# EAGLE design main (EAGLE 5.06)
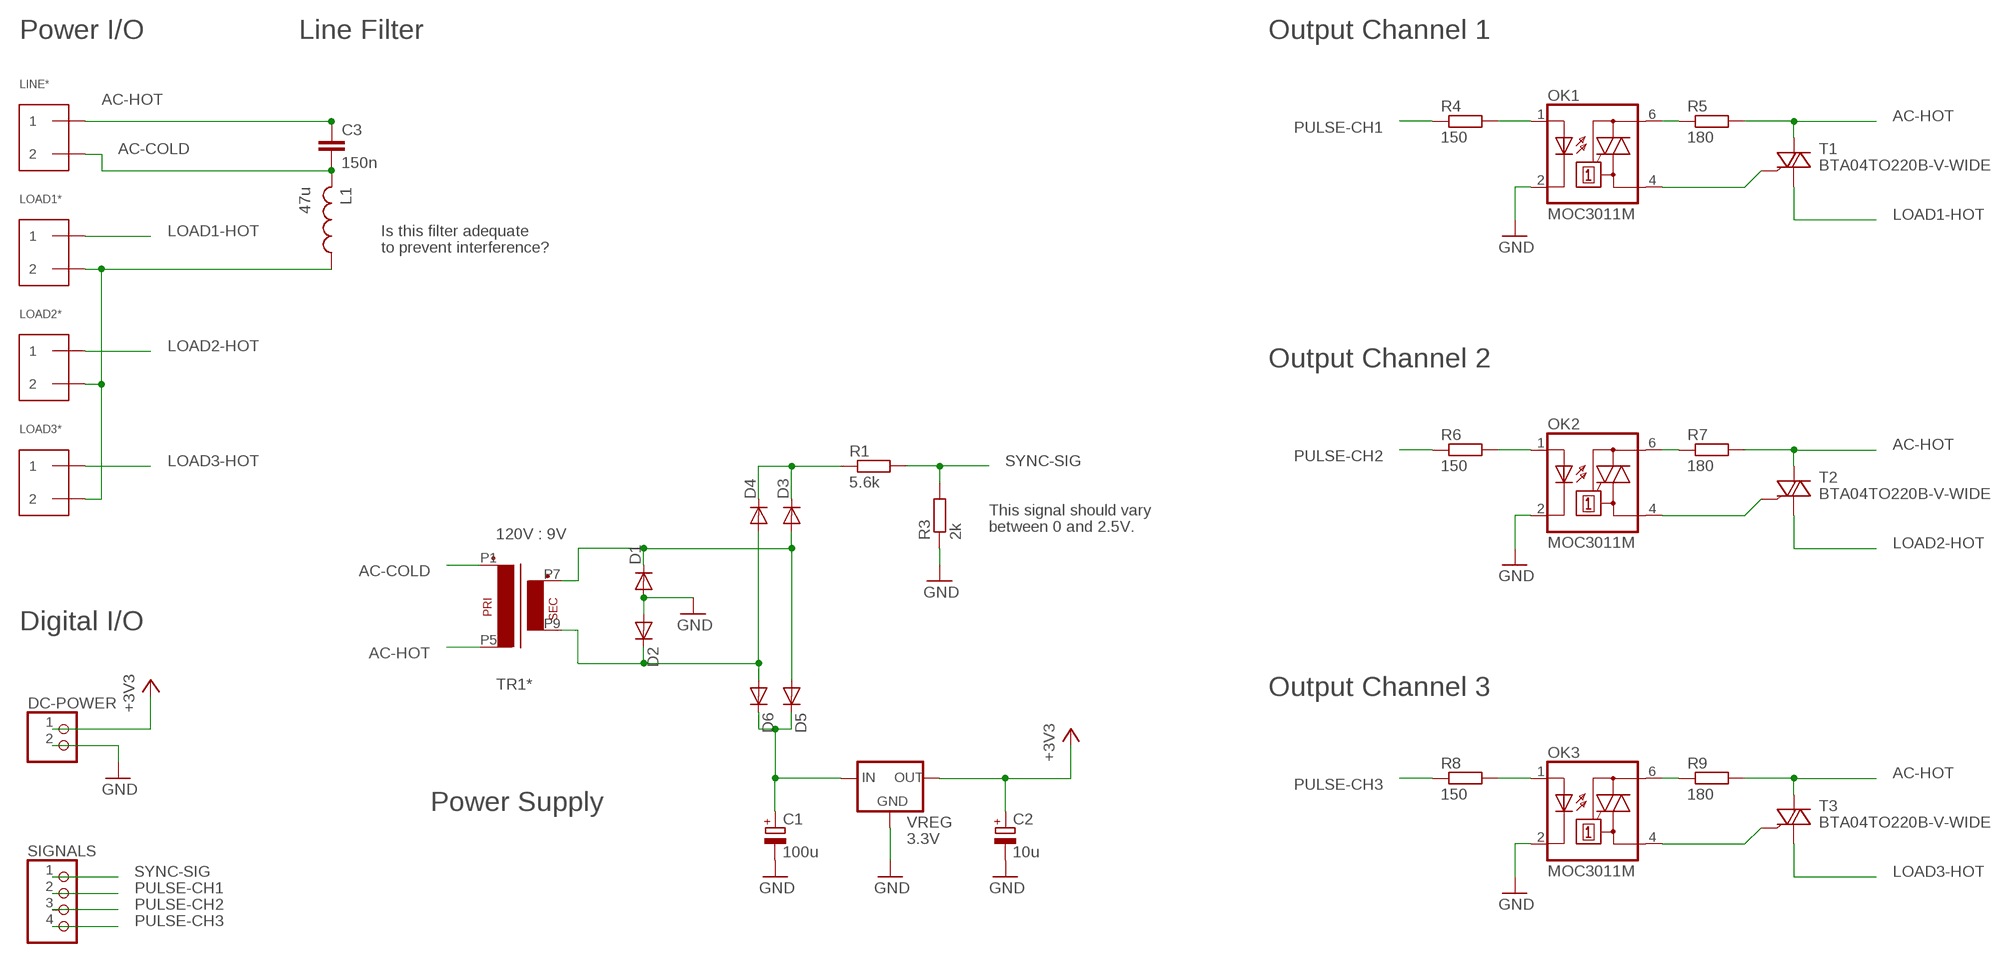
[diagram p0: schematic, sheet 1]

## Parts
C1  100u  CPOL-EUE3.5-8  [E3,5-8]
C2  10u  CPOL-EUE2.5-5  [E2,5-5]
C3  150n  C-EUC1812  [C1812]
D1  1N4148DO35-7  [DO35-7]
D2  1N4148DO35-7  [DO35-7]
D3  1N4148DO35-7  [DO35-7]
D4  1N4148DO35-7  [DO35-7]
D5  1N4148DO35-7  [DO35-7]
D6  1N4148DO35-7  [DO35-7]
DC-POWER  PINHD-1X2STRAIGHT  [1X02]
L1  47u  MURATA-14001447385C  [MURATA-1447385C]
LINE*  TERMINAL-1X2  [TERM-1X2]
LOAD1*  TERMINAL-1X2  [TERM-1X2]
LOAD2*  TERMINAL-1X2  [TERM-1X2]
LOAD3*  TERMINAL-1X2  [TERM-1X2]
OK1  MOC3011M  [DIL06]
OK2  MOC3011M  [DIL06]
OK3  MOC3011M  [DIL06]
R1  5.6k  R-EU_R0805  [R0805]
R3  2k  R-EU_R0805  [R0805]
R4  150  R-EU_R0805  [R0805]
R5  180  R-EU_0207/10  [0207/10]
R6  150  R-EU_R0805  [R0805]
R7  180  R-EU_0207/10  [0207/10]
R8  150  R-EU_R0805  [R0805]
R9  180  R-EU_0207/10  [0207/10]
SIGNALS  PINHD-1X4  [1X04]
T1  BTA04TO220B-V-WIDE  [TO220B-VERT-WIDE]
T2  BTA04TO220B-V-WIDE  [TO220B-VERT-WIDE]
T3  BTA04TO220B-V-WIDE  [TO220B-VERT-WIDE]
TR1*  120V : 9V  TRANFORMER-1P1SPULSE-EL30  [PULSE-TRANSF-EL30]
VREG  3.3V  UA78MXXSOT223  [SOT223]

## Nets
+3V3: C2.+ DC-POWER.1 VREG.3(VOUT)
AC-COLD [AC]: C3.2 L1.P$2 LINE*.2 TR1*.P1(P2)
AC-HOT [AC]: C3.1 LINE*.1 R5.2 R7.2 R9.2 T1.2(A2) T2.2(A2) T3.2(A2) TR1*.P5(P1)
GND: C1.- C2.- D1.A D2.A DC-POWER.2 OK1.2(C) OK2.2(C) OK3.2(C) R3.1 VREG.2(GND)
LOAD1-HOT [AC]: LOAD1*.1 T1.1(A1)
LOAD2-HOT [AC]: LOAD2*.1 T2.1(A1)
LOAD3-HOT [AC]: LOAD3*.1 T3.1(A1)
LOAD-COLD [AC]: L1.P$1 LOAD1*.2 LOAD2*.2 LOAD3*.2
N$1: C1.+ D5.C D6.C VREG.1(VIN)
N$2: D1.C D3.A D5.A TR1*.P7(S3)
N$3: D2.C D4.A D6.A TR1*.P9(S4)
N$4: D3.C D4.C R1.1
N$5: OK1.1(A) R4.2
N$6 [AC]: OK1.4(A1) T1.3(G)
N$7 [AC]: OK1.6(A2) R5.1
N$8: OK2.1(A) R6.2
N$9 [AC]: OK2.4(A1) T2.3(G)
N$10 [AC]: OK2.6(A2) R7.1
N$11: OK3.1(A) R8.2
N$12 [AC]: OK3.4(A1) T3.3(G)
N$13 [AC]: OK3.6(A2) R9.1
PULSE-CH1: R4.1 SIGNALS.2
PULSE-CH2: R6.1 SIGNALS.3
PULSE-CH3: R8.1 SIGNALS.4
SYNC-SIG: R1.2 R3.2 SIGNALS.1

## Notes on the sheet
- Power I/O | Line Filter | Output Channel 1
- Is this filter adequate
- to prevent interference?
- Output Channel 2
- This signal should vary
- between 0 and 2.5V.
- Digital I/O
- Output Channel 3
- Power Supply

## Library data of the parts
C1 C2 = rcl:CPOL-EU: POLARIZED CAPACITOR, European symbol
C3 = rcl:C-EU: CAPACITOR, European symbol
D1-D6 = diode:1N4148: DIODE high speed (Philips)
DC-POWER = pinhead:PINHD-1X2: PIN HEADER
L1 = adam - passive:MURATA-1400: Murata 1400 series inductor
LINE* LOAD1* LOAD2* LOAD3* = adam - mechanical:TERMINAL-1X2
OK1-OK3 = optocoupler:MOC30*M: RANDOM-PHASE OPTOISOLATORS TRIAC DRIVER OUTPUT Source: http://www.fairchildsemi.com MOC3020-M.pdf
R1 R3-R9 = rcl:R-EU_: RESISTOR, European symbol
SIGNALS = pinhead:PINHD-1X4: PIN HEADER
T1-T3 = adam - transistors etc:BTA04: BTA04 TRIAC high gate sensitivity and isolated tab
TR1* = adam - passive:TRANFORMER-1P1S: TRANSFORMER 1 primary winding, 1 secondary winding ERA
VREG = adam - ics:UA78MXX: UA78Mxx voltage regulator available in various fixed voltages

## Net classes
1 AC: width 1.27 mm, clearance 1.194 mm
2 AC fill: clearance 1.778 mm

## Board
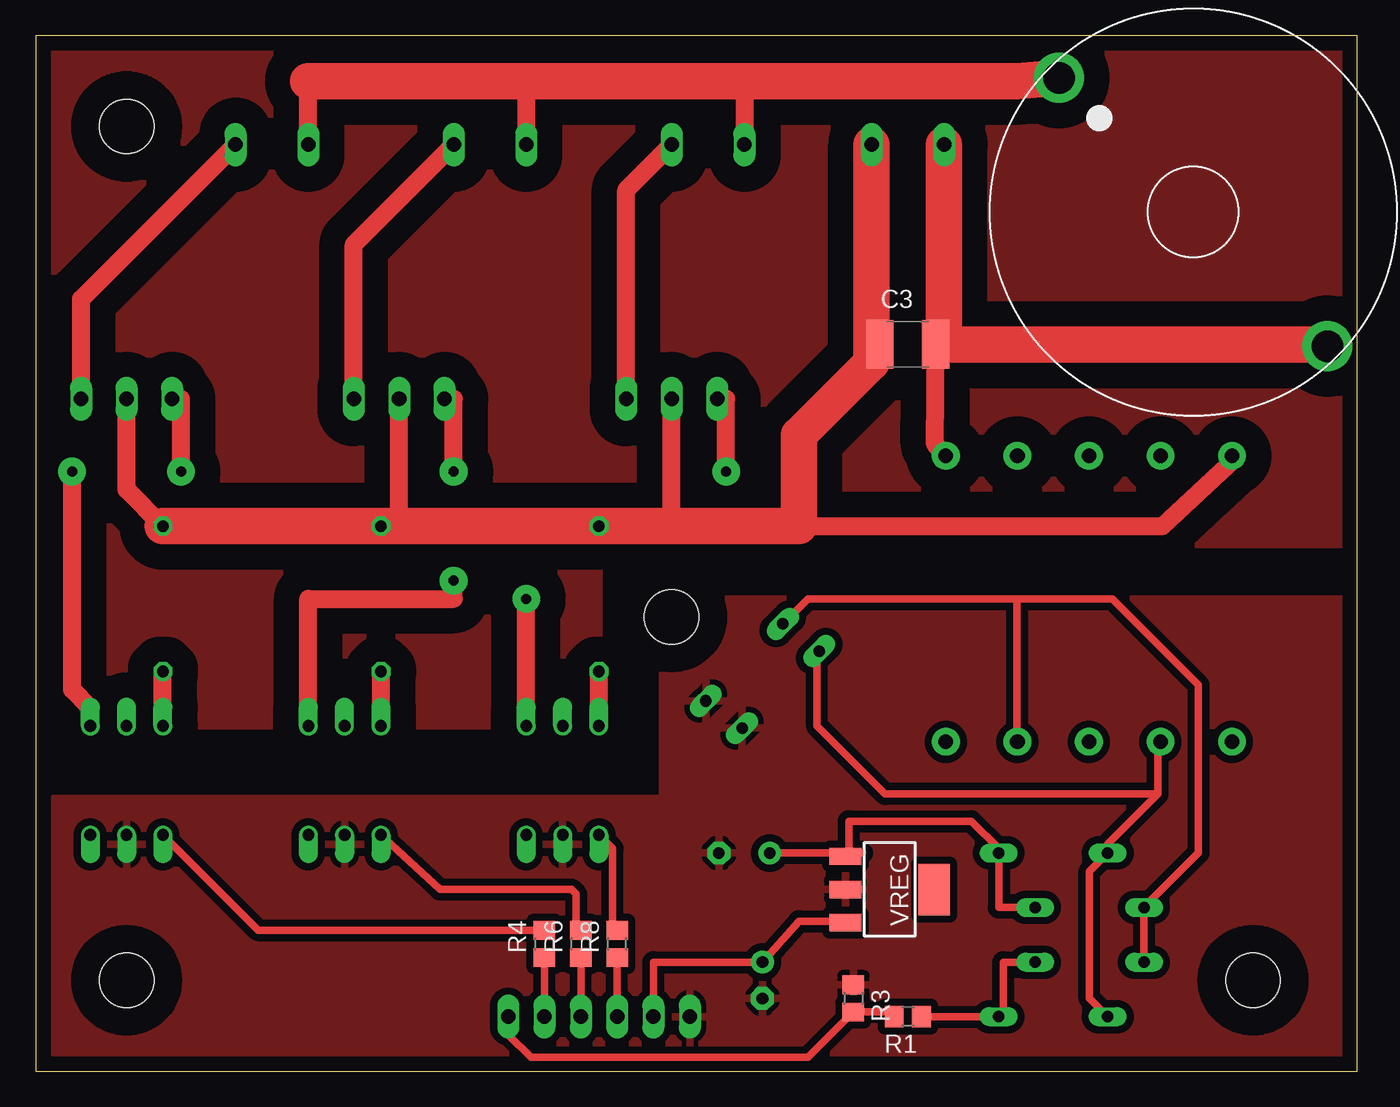
[diagram p1: board, top side]
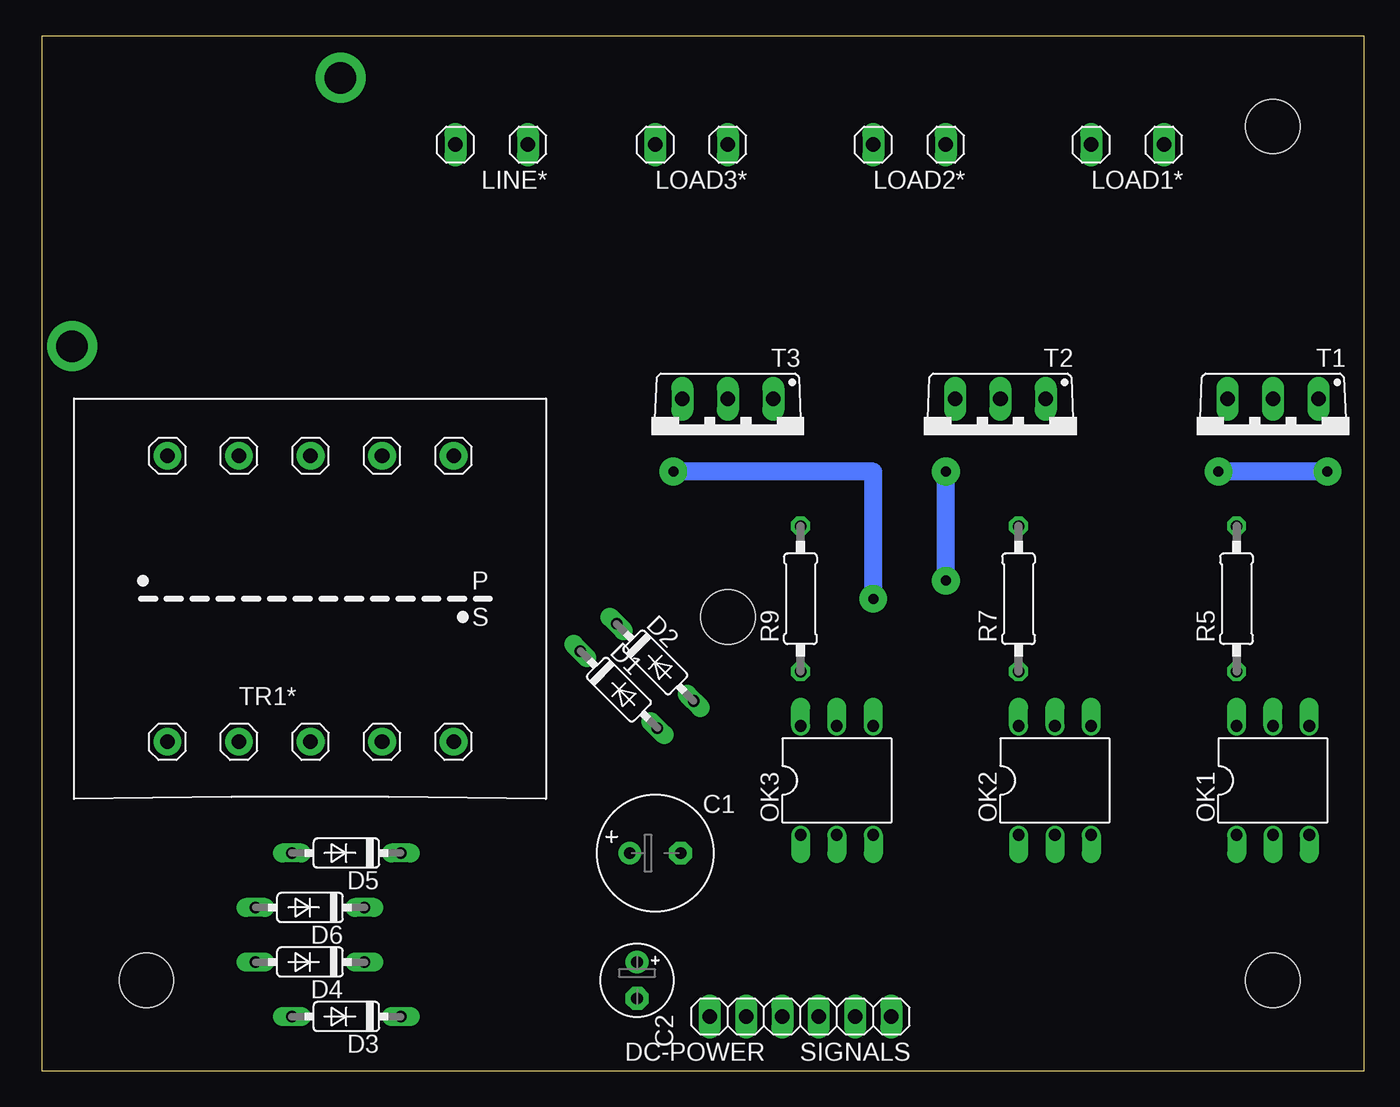
[diagram p2: board, bottom side, seen from below]

Size 92.38 x 72.38 mm. Coordinates in mm from the lower left corner, seen from the top.
Outline: 0,0 92.38,0 92.38,72.38 0,72.38 0,0
Copper layers (1*16): Top 0.035mm / dielectric 1.5mm / Bottom 0.035mm
Design rules "20mil all": minimum track width 20mil, minimum drill 24mil, track to track 20mil, track to pad 20mil, pad to pad 20mil, via to via 20mil, smd to smd 8mil, copper to edge 40mil, drill to drill 8mil, minimum pad ring 10mil, minimum via ring 8mil, stop-mask expansion 4mil, vias tented up to drill 0mil, thermal gap 15mil

### Footprints (pad centres in the part's own frame; a part is rotated, then mirrored left to right if it is on the bottom)
E3,5-8 = drill 0.813 pad 1.6 round: + -1.778,0 | drill 0.813 pad 1.6 octagon: - 1.778,0
E2,5-5 = drill 0.813 pad 1.6 round: + -1.27,0 | drill 0.813 pad 1.6 octagon: - 1.27,0
C1812 = smd 1.9 x 3.4: 1 -1.95,0; 2 1.95,0
DO35-7 = drill 0.813 long: A 3.81,0; C -3.81,0
1X02 = drill 1.016 long: 1 -1.27,0; 2 1.27,0
MURATA-1447385C = drill 2.2 pad 3.5 round: P$1 -12,0; P$2 14.54,0
TERM-1X2 = drill 1.016 long: 1 -2.54,0; 2 2.54,0
DIL06 = drill 0.813 offset: 1 -2.54,-3.81; 2 0,-3.81; 3 2.54,-3.81; 4 2.54,3.81; 5 0,3.81; 6 -2.54,3.81
R0805 = smd 1.3 x 1.5: 1 -0.95,0; 2 0.95,0
0207/10 = drill 0.813 octagon: 1 -5.08,0; 2 5.08,0
1X04 = drill 1.016 long: 1 -3.81,0; 2 -1.27,0; 3 1.27,0; 4 3.81,0
TO220B-VERT-WIDE = drill 1.016 long: 1 -3.175,0; 2 0,0; 3 3.175,0
PULSE-TRANSF-EL30 = drill 1.016 pad 1.93 round: P1 -10.04,-10; P2 -5.04,-10; P3 -0.04,-10; P4 4.96,-10; P5 9.96,-10; P6 9.96,10; P7 4.96,10; P8 -0.04,10; P9 -5.04,10; P10 -10.04,10
PCB-MOUNT = hole 3.797: 0,0
SOT223 = smd 1.219 x 2.235: 1 -2.311,-3.099; 2 0,-3.099; 3 2.311,-3.099 | smd 3.6 x 2.2: 4-TAB 0,3.099

### Placement (x,y rotation side)
C1  49.53,15.24 0 bottom
C2  50.8,6.35 270 bottom
C3  60.96,50.8 0 top
D1  52.07,26.67 315 bottom
D2  49.53,28.58 315 bottom
D3  71.12,3.81 180 bottom
D4  73.66,7.62 180 bottom
D5  71.12,15.24 180 bottom
D6  73.66,11.43 180 bottom
DC-POWER  44.45,3.81 180 bottom
L1  80.01,60.96 315 top
LINE*  60.96,64.77 180 bottom
LOAD1*  16.51,64.77 180 bottom
LOAD2*  31.75,64.77 180 bottom
LOAD3*  46.99,64.77 180 bottom
OK1  6.35,20.32 0 bottom
OK2  21.59,20.32 0 bottom
OK3  36.83,20.32 0 bottom
R1  60.96,3.81 180 top
R3  57.15,5.08 270 top
R4  35.56,8.89 90 top
R5  8.89,33.02 90 bottom
R6  38.1,8.89 90 top
R7  24.13,33.02 90 bottom
R8  40.64,8.89 90 top
R9  39.37,33.02 90 bottom
SIGNALS  36.83,3.81 180 bottom
T1  6.35,46.99 180 bottom
T2  25.4,46.99 180 bottom
T3  44.45,46.99 180 bottom
TR1*  73.66,33.02 180 bottom
U$1  [PCB-MOUNT]  6.35,66.04 0 top
U$2  [PCB-MOUNT]  6.35,6.35 0 top
U$3  [PCB-MOUNT]  85.09,6.35 0 top
U$4  [PCB-MOUNT]  44.45,31.75 0 top
VREG  59.69,12.7 270 top

### Tracks (layer width: path | path; a pad name or v marks a point on that pad's centre or on a via)
+3V3
  Top 0.508: VREG.3 56.52,10.48 53.34,10.48 C2.+ 43.18,7.62 DC-POWER.1
AC-COLD
  Top 1.27: LINE*.2 63.82,58.1 | 63.5,51.44 63.18,51.12 C3.2 62.87,43.81 TR1*.P1
  Top 2.54: LINE*.2 63.5,51.44 64.14,50.8 90.29,50.8 L1.P$2
AC-HOT
  Top 1.27: R5.2 6.35,40.64 T1.2 | 44.45,38.1 T3.2 | 25.4,38.1 T2.2 | 59.05,50.8 C3.1 58.42,50.8 | TR1*.P5 83.82,42.82 78.74,38.1 46.99,38.1
  Top 2.54: LINE*.1 58.42,50.8 58.42,49.53 53.34,44.45 53.34,38.1 46.99,38.1 44.45,38.1 R9.2 25.4,38.1 R7.2 R5.2
GND
  pour Top: 1.27,19.05 43.81,19.05 43.81,33.02 91.44,33.02 91.44,1.27 1.27,1.27
LOAD1-HOT
  Top 1.27: T1.1 3.17,53.98 LOAD1*.1
LOAD2-HOT
  Top 1.27: T2.1 22.23,57.79 LOAD2*.1
LOAD3-HOT
  Top 1.27: T3.1 41.27,61.6 LOAD3*.1
LOAD-COLD
  Top 1.27: LOAD1*.2 19.05,69.22 | 34.29,69.22 LOAD2*.2 | 49.53,69.22 LOAD3*.2
  Top 2.54: 19.05,69.22 34.29,69.22 49.53,69.22 68.58,69.22 L1.P$1
N$1
  Top 0.508: D6.C 67.31,11.43 D5.C 67.31,15.56 65.41,17.46 56.83,17.46 56.83,15.24 | C1.+ 56.83,15.24 | 56.83,15.24 57.78,15.24 56.52,14.92 VREG.1 56.83,15.24
N$2
  Top 0.508: TR1*.P7 78.42,22.86 78.42,19.37 | 78.42,19.37 74.93,15.88 D5.A 73.66,13.97 73.66,5.08 D3.A | D1.C 54.61,29.21 54.61,24.13 59.37,19.37 78.42,19.37
N$3
  Top 0.508: D4.A D6.A 81.28,15.24 81.28,26.99 75.25,33.02 68.58,33.02 | 68.58,33.02 68.58,23.18 TR1*.P9 | D2.C 53.98,33.02 68.58,33.02
N$4
  Top 0.508: R1.1 D3.C 67.63,4.13 67.63,7.62 D4.C
N$5
  Top 0.508: OK1.1 15.56,9.84 R4.2
N$6  (via drill 0.7 pad 1.93)
  Top 1.27: OK1.4 3.81,25.4 2.54,26.67 v2.54,41.91 | v10.16,41.91 10.16,46.99 T1.3
  Bottom 1.27: v2.54,41.91 v10.16,41.91
N$7
  Top 1.27: OK1.6 R5.1
N$8
  Top 0.508: OK2.1 24.45,16.19 28.26,12.7 37.47,12.7 37.78,12.38 37.78,10.16 R6.2
N$9  (via drill 0.7 pad 1.93)
  Top 1.27: OK2.4 19.05,33.02 29.21,33.02 v29.21,34.29 | v29.21,41.91 29.21,46.99 T2.3
  Bottom 1.27: v29.21,34.29 v29.21,41.91
N$10
  Top 1.27: OK2.6 R7.1
N$11
  Top 0.508: R8.2 40.32,10.16 40.32,15.56 OK3.1
N$12  (via drill 0.7 pad 1.93)
  Top 1.27: OK3.4 v34.29,33.02 | v48.26,41.91 48.26,46.99 T3.3
  Bottom 1.27: v34.29,33.02 34.29,41.91 v48.26,41.91
N$13
  Top 1.27: OK3.6 R9.1
N$14
  pour Top: 1.27,24.13 1.27,71.12 91.44,71.12 91.44,36.83 39.37,36.83 39.37,24.13
PULSE-CH1
  Top 0.508: SIGNALS.2 R4.1
PULSE-CH2
  Top 0.508: SIGNALS.3 R6.1
PULSE-CH3
  Top 0.508: SIGNALS.4 R8.1
SYNC-SIG
  Top 0.508: SIGNALS.1 33.02,2.54 34.61,0.95 53.98,0.95 53.98,0.96 R3.2 59.69,4.13 R1.2

### Text on the board
Document: end right in the power bus.
tDocu: * The 180 ohm resistors should't | The TO-220 packages have | room for a .65" heatsink.